# Altium schematic sheet PowerSupply.SchDoc
size A4
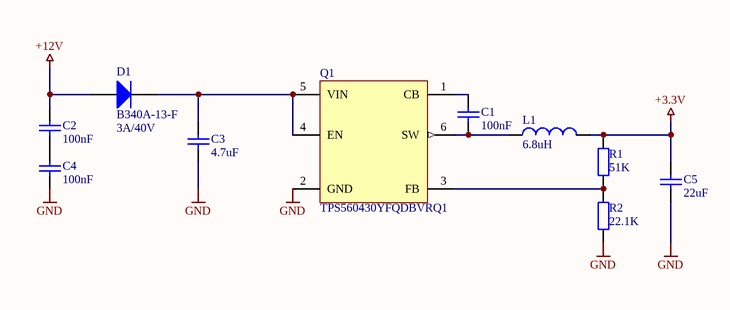
[diagram p0: PowerSupply.SchDoc]

## Parts
C1  value 100nF  [CAPC1608X08N]  (hidden comment: CGA3E2X7R1H104K080AA)
C2  value 100nF  [CAPC1608X08N]  (hidden comment: CGA3E2X7R1H104K080AA)
C3  value 4.7uF  [CAPC2012X14N]  (hidden comment: CGA4J3X5R1H475K125AB)
C4  value 100nF  [CAPC1608X08N]  (hidden comment: CGA3E2X7R1H104K080AA)
C5  value 22uF  [CAPC3225X28N]  (hidden comment: CGA6P1X7R1C226M250AC)
D1  B340A-13-F  value 3A/40V  [DIOM4326X24N]
L1  value 6.8uH  [INDP3532X20N]  (hidden comment: SRP3020TA-6R8M)
Q1  TPS560430YFQDBVRQ1  [SOT95P280X110-6N]
R1  value 51K  [RESC1608X04N]  (hidden comment: ERJ-3EKF5102V)
R2  value 22.1K  [RESC1608X04N]  (hidden comment: ERJ-3EKF2212V)

## Nets
+3.3V: C5.2 L1.2 R1.2
+12V: C2.2 D1.1(A)
GND: C3.1 C4.1 C5.1 Q1.2(GND) R2.1
NetC1_1: C1.1 L1.1 Q1.6(SW)
NetC1_2: C1.2 Q1.1(CB)
NetC2_1: C2.1 C4.2
NetC3_2: C3.2 D1.2(K) Q1.4(EN) Q1.5(VIN)
NetQ1_3: Q1.3(FB) R1.1 R2.2

## Library data of the parts
C1 C2 C4 = C0603-100nF-50V: 0603 Capacitor, 100nF; Supplier 1: Mouser; Supplier Part Number 1: 810-CGA3E2X7R1H104K
C3 = C0805-4.7uF-50V: 0805 Capacitor, 4.7uF; Supplier 1: Mouser; Supplier Part Number 1: 810-CGA4J3X5R1H475K
C5 = C1210-22uF-16V: 1210 Capacitor, 22uF; Supplier 1: Mouser; Supplier Part Number 1: 810-CGA6P1X7R1C226M
D1 = D-SCH-3A-40V: Schottky Diode, 3A, 40A; Supplier 1: Mouser; Supplier Part Number 1: 621-B340A-F
L1 = IND-6.8uH-1.9A: Inductor 6.8uH, 1.9A, 2.2A Isat; Supplier 1: Mouser; Supplier Part Number 1: 652-SRP3020TA-6R8M
Q1 = TPS560430YF: TPS560430-Q1 SIMPLE SWITCHER 4-V to 36-V, 600-mA Synchronous Buck Converter; Supplier 1: Mouser; Supplier Part Number 1: 595-S560430YFQDBVRQ1
R1 = R0603R51K: 0603 Resistor; Supplier 1: Mouser; Supplier Part Number 1: 667-ERJ-3EKF5102V
R2 = R0603R22.1K: 0603 Resistor; Supplier 1: Mouser; Supplier Part Number 1: 667-ERJ-3EKF2212V